# Altium schematic sheet Main.SchDoc: USB Relay Module: MCU
size A4; DrawnBy: A.G.; DocumentNumber: 1; Revision: A; SheetNumber: 1; SheetTotal: 3
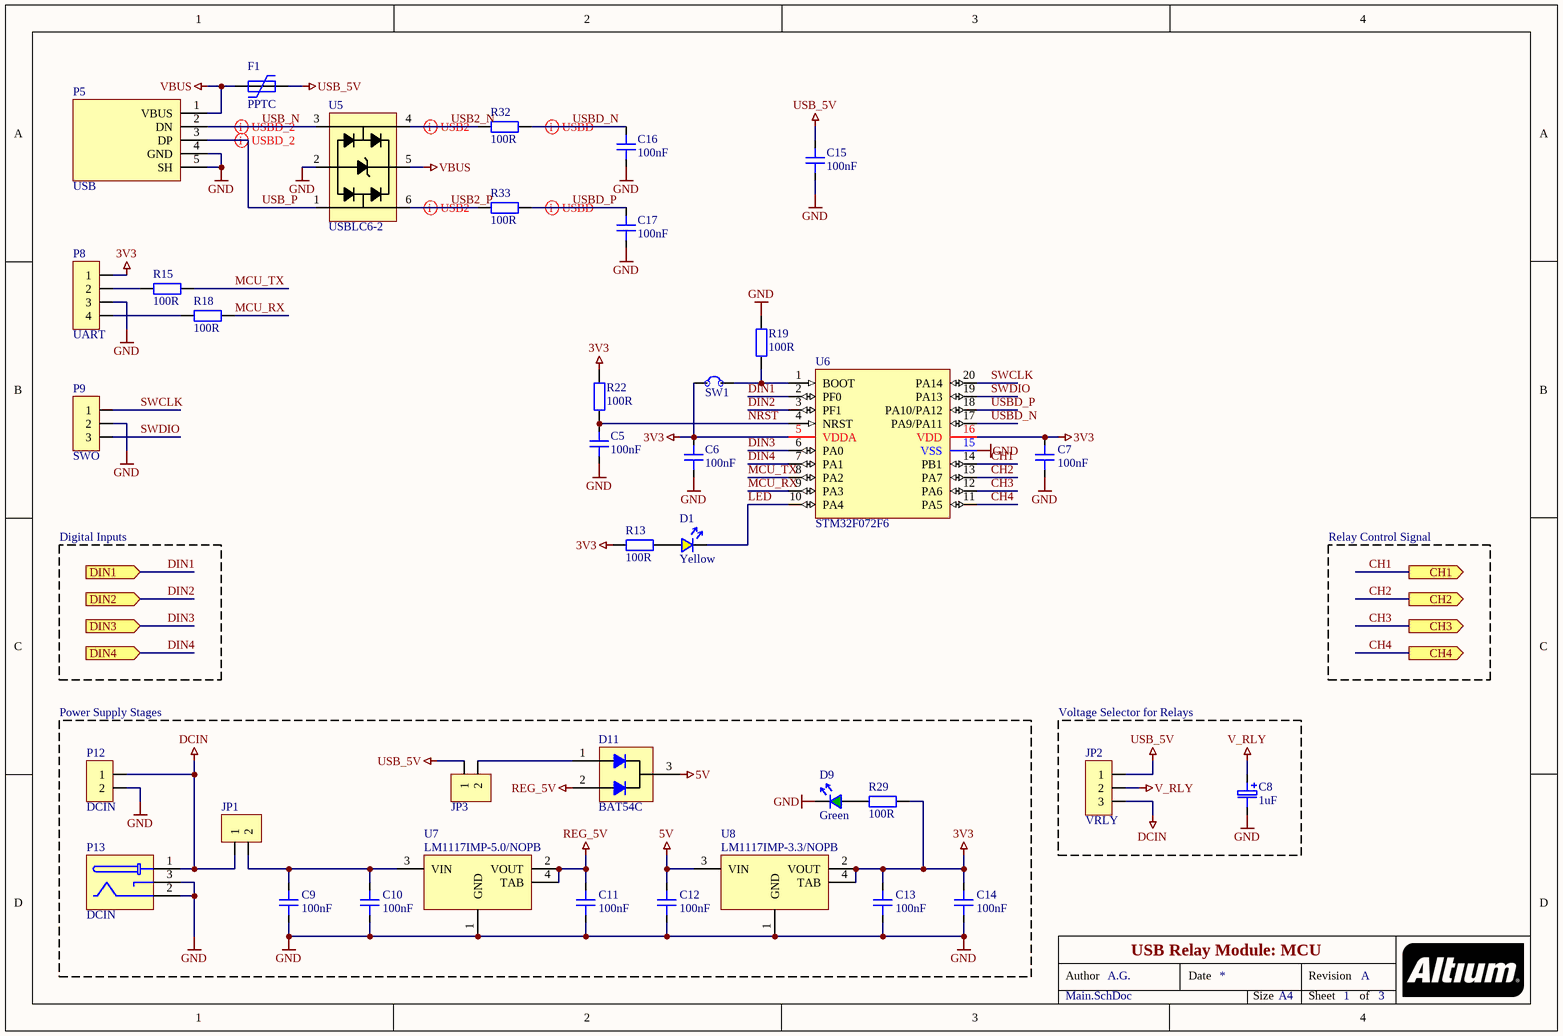
[diagram p0: Main.SchDoc]

## Parts
C5  100nF  [C0805]
C6  100nF  [C0805]
C7  100nF  [C0805]
C8  1uF  [C_EL_6.3]
C9  100nF  [C0805]
C10  100nF  [C0805]
C11  100nF  [C0805]
C12  100nF  [C0805]
C13  100nF  [C0805]
C14  100nF  [C0805]
C15  100nF  [C0805]
C16  100nF  [C0805]
C17  100nF  [C0805]
D1  Yellow  [LED1206]
D9  Green  [LED1206]
D11  BAT54C  [SOT-23-127P600-8N]
F1  PPTC  [MF-MSMF110/16-2]
JP1  PINHDR_2x1  [HEADER-2.54-2P1]  (value not drawn)
JP2  VRLY  [HEADER-2.54-3P1]
JP3  (no value)  [HEADER-2.54-2P1]
P5  USB  [UJ2-BH-2-TH]
P8  UART  [HEADER-2.54-4P1]
P9  SWO  [HEADER-2.54-3P1]
P12  DCIN  [HEADER-2.54-2P1]
P13  DCIN  [CON JACK PWR 2.5mm PJ-002BH - duplicate]
R13  100R  [R0805]
R15  100R  [R0805]
R18  100R  [R0805]
R19  100R  [R0805]
R22  100R  [R0805]
R29  100R  [R0805]
R32  100R  [R0805]
R33  100R  [R0805]
SW1  SolderBridge-1  [R0805]  (value not drawn)
U5  USBLC6-2  [USBLC6-2-SOT95P280X145-6N]
U6  STM32F072F6  [TSSOP-20]
U7  LM1117IMP-5.0/NOPB  [SOT-223_127P600-8N]
U8  LM1117IMP-3.3/NOPB  [SOT-223_127P600-8N]

## Blocks framed on the sheet
Power Supply Stages: C9-C14 D9 D11 JP1 JP3 P12 P13 R29 U7 U8
Voltage Selector for Relays: C8 JP2

## Ports
CH1 (out), CH2 (out), CH3 (out), CH4 (out), DIN1 (in), DIN2 (in), DIN3 (in), DIN4 (in)

## Nets
3V3: C6.2 C7.2 C13.2 C14.2 P8.1 R13.2 R22.1 R29.2 SW1.1 U6.5(VDDA) U6.16(VDD) U8.2(VOUT) U8.4(TAB)
5V: C12.2 D11.3(C) U8.3(VIN)
DCIN: JP1.1 JP2.3 P12.1 P13.1
GND: C5.1 C6.1 C7.1 C8.2 C9.1 C10.1 C11.1 C12.1 C13.1 C14.1 C15.1 C16.1 C17.1 D9.2(C) P5.4(GND) P5.5(SH) P8.3 P9.2 P12.2 P13.2 P13.3 R19.1 U5.2 U6.15(VSS) U7.1(GND) U8.1(GND)
REG_5V: C11.2 D11.2(A2) U7.2(VOUT) U7.4(TAB)
USB_5V: C15.2 F1.1 JP2.1 JP3.1
V_RLY: C8.1 JP2.2
VBUS: F1.2 P5.1(VBUS) U5.5
CH1: U6.14(PB1) ; port CH1
CH2: U6.13(PA7) ; port CH2
CH3: U6.12(PA6) ; port CH3
CH4: U6.11(PA5) ; port CH4
DIN1: U6.2(PF0) ; port DIN1
DIN2: U6.3(PF1) ; port DIN2
DIN3: U6.6(PA0) ; port DIN3
DIN4: U6.7(PA1) ; port DIN4
LED: D1.2(C) U6.10(PA4)
MCU_RX: R18.2 U6.9(PA3)
MCU_TX: R15.2 U6.8(PA2)
NRST: C5.2 R22.2 U6.4(NRST)
SWCLK: P9.1 U6.20(PA14)
SWDIO: P9.3 U6.19(PA13)
USB2_N: R32.1 U5.4
USB2_P: R33.1 U5.6
USB_N: P5.2(DN) U5.3
USB_P: P5.3(DP) U5.1
USBD_N: C16.2 R32.2 U6.17(PA9/PA11)
USBD_P: C17.2 R33.2 U6.18(PA10/PA12)
NetC9_2: C9.2 C10.2 JP1.2 U7.3(VIN)
NetD1_1: D1.1(A) R13.1
NetD9_1: D9.1(A) R29.1
NetD11_1: D11.1(A1) JP3.2
NetP8_2: P8.2 R15.1
NetP8_4: P8.4 R18.1
NetR19_2: R19.2 SW1.2 U6.1(BOOT)

## Layout directives
differential pair: USB2_N, USB2_P, USB_N, USB_P, USBD_N, USBD_P

## Notes on the sheet
- Digital Inputs
- Relay Control Signal
- Author
- Date
- Revision
- Size
- A4
- Sheet
- of

## Library data of the parts
C5-C7 C9-C17 = C: Generic Capacitor; Tolerance: 20%; Value: 100nF; MountingTechnology: SMT; BaseProduct: *
C8 = CP: Generic Polarized Capacitor; Value: 1uF
D1 = LED_YELLOW: Generic LED (Yellow); ForwardVoltage: 2.1V; EmittingColor: Yellow
D9 = LED_GREEN: Generic LED (Green); ForwardVoltage: 2.1V; EmittingColor: Green
D11 = BAT54C: DIODE ARRAY SCHOTTKY COMM CATH 30V 0.2A SOT-23; PartNo: BAT54C-FDICT-ND; Manufacturer: Diodes Incorporated; DiodeConfiguration: 1 Pair Common Cathode; ProductNumber: BAT54C-7-F; BaseProduct: BAT54C; Supplier: DigiKey; URL: https://www.digikey.com/en/products/detail/diodes-incorporated/BAT54C-7-F/717701; MountingTechnology: SMT; UnitPrice: $0.18; Package: SOT-23-3
F1 = PPTC: PolyFuse (LittleFuse)
JP1 JP3 P12 = PINHDR_2x1: Generic Pin Header 2x1
JP2 P9 = PINHDR_3x1: Generic Pin Header 3x1
P5 = UJ2-BH-2-TH: CONN RCPT USB2.0 TYPEB 4POS R/A; pin to pad: 5>SH; PartNo: 102-5884-ND; Manufacturer: CUI Devices; ProductNumber: UJ2-BH-2-TH; UnitPrice: $0.62; URL: https://www.digikey.com/en/products/detail/cui-devices/UJ2-BH-2-TH/6188079; MountingTechnology: HMT
P8 = PINHDR_4x1: Generic Pin Header 4x1
P13 = PJ-002BH: CONN PWR JACK 2.5X5.5MM SOLDER; Manufacturer: CUI Devices; PartNo: CP-002BH-ND; Supplier: DigiKey; ProductNumber: PJ-002BH; URL: https://www.digikey.com/en/products/detail/cui-devices/PJ-002BH/408447; UnitPrice: $0.74; MountType: THT
R13 R15 R18 R19 R22 R29 R32 R33 = R: Generic Resistor; Tolerance: 1%; Value: 100R; MountingTechnology: SMT; BaseProduct: *
SW1 = SolderBridge-1: PCB Solder Bridge
U5 = USBLC6-2: Low capacitance USB ESD protection
U6 = STM32F072F6P6: IC MCU 32BIT 32KB FLASH 20TSSOP; PartNo: 497-17354-1-ND; ProductNumber: STM32F070F6P6TR; BaseProduct: STM32F07x; URL: https://www.digikey.com/en/products/detail/stmicroelectronics/STM32F070F6P6TR/7313047; Supplier: DigiKey; Package: TSSOP-20; VisibleName: STM32F072F6
U7 = LM1117IMP-5.0/NOPB: IC REG LINEAR 5V 800MA SOT223; PartNo: LM1117IMP-5.0/NOPBCT-ND; Manufacturer: Texas Instruments; DetailedDescription: Linear Voltage Regulator IC Output 800mA SOT-223; ShippingPackage: Cut Tape (CT); MaxInputVoltage: 15V; VoltageDropout: 1.2V; Supplier: DigiKey; URL: https://www.digikey.com/en/products/detail/texas-instruments/LM1117IMP-5-0-NOPB/482940; UnitPrice: $1.10; Package: SOT-223; OutputVoltage: 5V; OutputCurrent: 800mA; ProductNumber: LM1117IMP-5.0/NOPB
U8 = LM1117IMP-3.3/NOPB: IC REG LINEAR 3.3V 800MA SOT223; PartNo: LM1117IMP-3.3/NOPBCT-ND; Manufacturer: Texas Instruments; DetailedDescription: Linear Voltage Regulator IC Output 800mA SOT-223; ShippingPackage: Cut Tape (CT); MaxInputVoltage: 15V; VoltageDropout: 1.2V; Supplier: DigiKey; URL: https://www.digikey.com/en/products/detail/texas-instruments/LM1117IMP-3-3-NOPB/482939; UnitPrice: $1.10; Package: SOT-223; OutputVoltage: 3.3V; OutputCurrent: 800mA; ProductNumber: LM1117IMP-3.3/NOPB